# Altium project tinyusbboard.PrjPcb
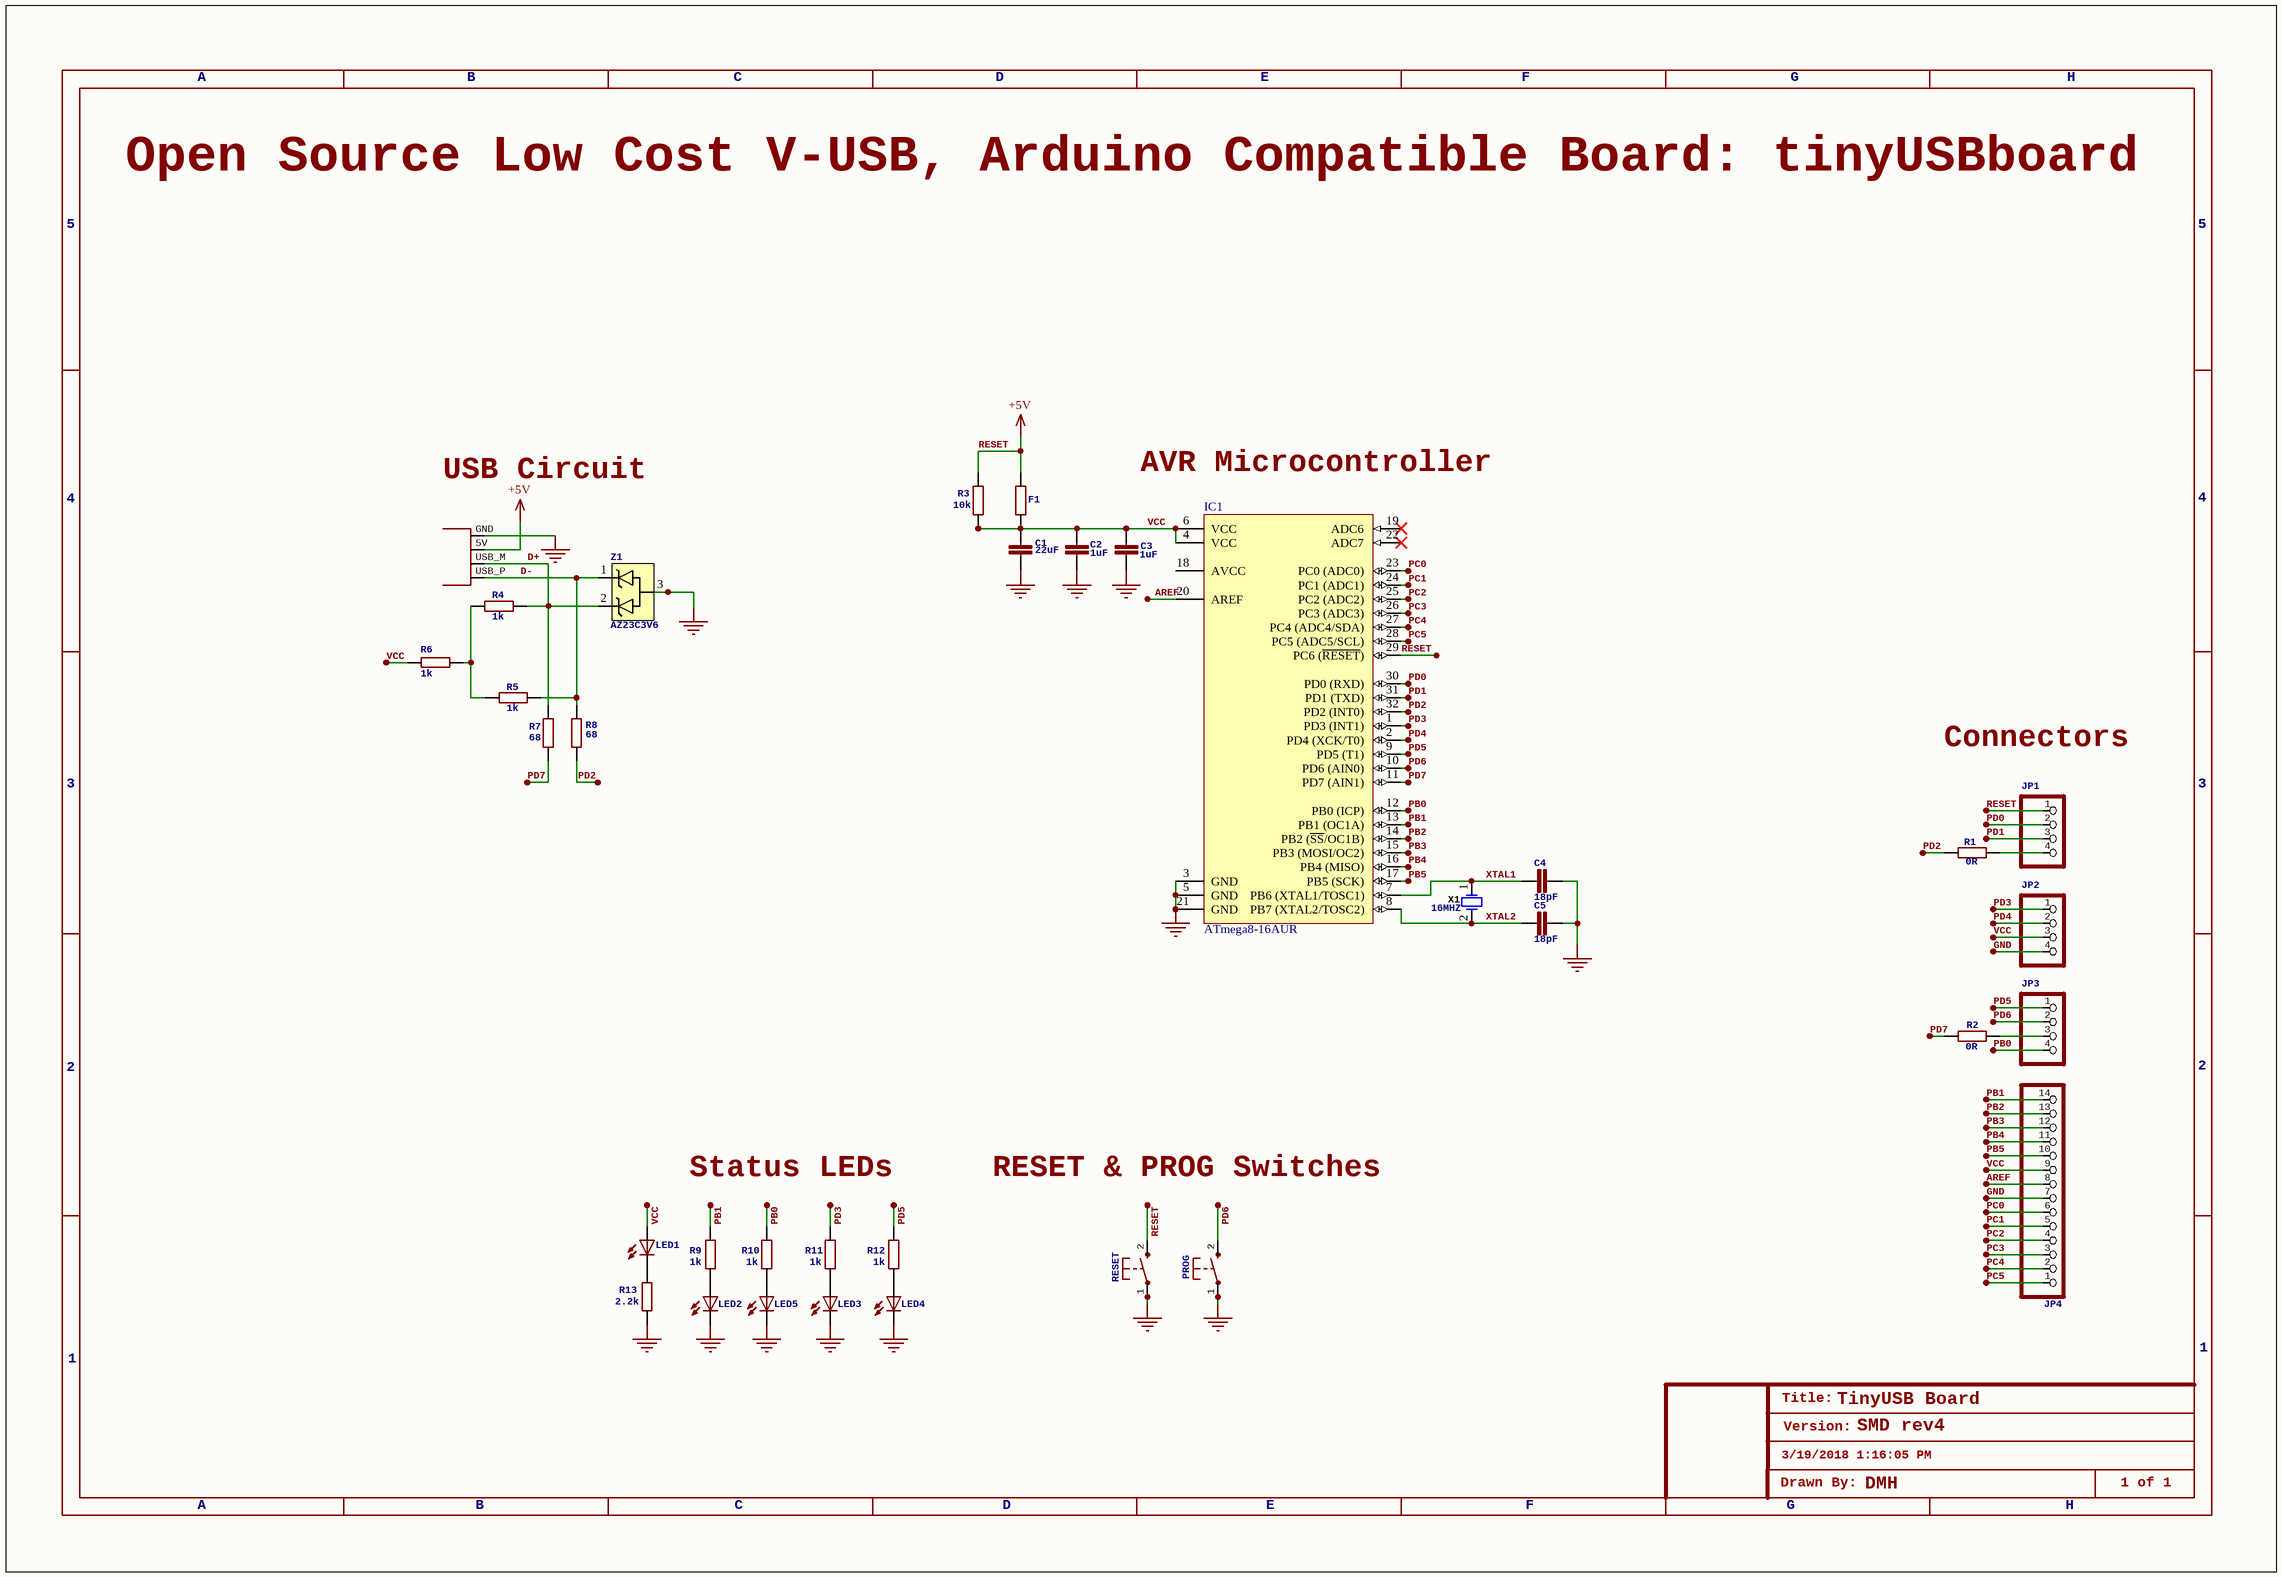
[diagram p0: tinyusbboard.SchDoc]
1 sheet, 34 parts. Net scope: global (net labels, ports and power ports of the same name join across sheets).
Board file: tinyusbboard.PcbDoc

## Sheet tinyusbboard.SchDoc: tinyusbboard
size 409 x 282 mm; Date: 3/19/2018 1:16:05 PM; CompanyName: Detex Corp; DrawnBy: DMH; Engineer: DMH; Organization: Detex Corp; Address1: 302 Detex Dr; Address2: New Braunfels, TX 78130; Revision: A0; SheetNumber: 1; SheetTotal: 1

### Parts
C1  22uF  [C1206K]
C2  1uF  [C0805]
C3  1uF  [C0805]
C4  18pF  [C0805]
C5  18pF  [C0805]
F1  0  [R1206W]  (value not drawn)
IC1  ATmega8-16AUR  [32A_M]
JP1  PINHD-1X4  [4P Jumper]  (value not drawn)
JP2  PINHD-1X4  [4P Jumper]  (value not drawn)
JP3  PINHD-1X4  [4P Jumper]  (value not drawn)
JP4  PINHD-1X14  [124P Jumper]  (value not drawn)
LED1  POWER  [LED_1206_2]  (value not drawn)
LED2  red  [LED_1206_2]  (value not drawn)
LED3  red  [LED_1206_2]  (value not drawn)
LED4  red  [LED_1206_2]  (value not drawn)
LED5  red  [LED_1206_2]  (value not drawn)
PROG  KSS-2EG4430  [KSS-2EG4430]  (value not drawn)
R1  0R  [RESC0805(2012)_M]
R2  0R  [RESC0805(2012)_M]
R3  10k  [RESC0805(2012)_M]
R4  1k  [RESC0805(2012)_M]
R5  1k  [RESC0805(2012)_M]
R6  1k  [RESC0805(2012)_M]
R7  68  [RESC0805(2012)_M]
R8  68  [RESC0805(2012)_M]
R9  1k  [RESC0805(2012)_M]
R10  1k  [RESC0805(2012)_M]
R11  1k  [RESC0805(2012)_M]
R12  1k  [RESC0805(2012)_M]
R13  2.2k  [RESC0805(2012)_M]
RESET  KSS-2EG4430  [KSS-2EG4430]  (value not drawn)
USB  USBPCB  [USB-A-PCB]  (value not drawn)
X1  16MHZ  [JPY-HC-49US]
Z1  AZ23C3V6  [SOT23_M]

### Nets
GND: C1.2 C2.2 C3.2 C4.2 C5.2 IC1.3(GND) IC1.5(GND) IC1.21(GND) JP2.4 JP4.7 LED2.C LED3.C LED4.C LED5.C PROG.1(P) R13.2 RESET.1(P) USB.GND Z1.3
RESET: F1.1 IC1.29(PC6_(~{RESET})) JP1.1 R3.1 RESET.2(S) USB.5V(VBUS)  [also labelled +5V]
AREF: IC1.20(AREF) JP4.8
D+: R4.2 R7.2 USB.USB_M(D-) Z1.2
D-: R5.2 R8.2 USB.USB_P(D+) Z1.1
PB0: IC1.12(PB0_(ICP)) JP3.4 R10.1
PB1: IC1.13(PB1_(OC1A)) JP4.14 R9.1
PB2: IC1.14(PB2_(~{SS}/OC1B)) JP4.13
PB3: IC1.15(PB3_(MOSI/OC2)) JP4.12
PB4: IC1.16(PB4_(MISO)) JP4.11
PB5: IC1.17(PB5_(SCK)) JP4.10
PC0: IC1.23(PC0_(ADC0)) JP4.6
PC1: IC1.24(PC1_(ADC1)) JP4.5
PC2: IC1.25(PC2_(ADC2)) JP4.4
PC3: IC1.26(PC3_(ADC3)) JP4.3
PC4: IC1.27(PC4_(ADC4/SDA)) JP4.2
PC5: IC1.28(PC5_(ADC5/SCL)) JP4.1
PD0: IC1.30(PD0_(RXD)) JP1.2
PD1: IC1.31(PD1_(TXD)) JP1.3
PD2: IC1.32(PD2_(INT0)) R1.1 R8.1
PD3: IC1.1(PD3_(INT1)) JP2.1 R11.1
PD4: IC1.2(PD4_(XCK/T0)) JP2.2
PD5: IC1.9(PD5_(T1)) JP3.1 R12.1
PD6: IC1.10(PD6_(AIN0)) JP3.2 PROG.2(S)
PD7: IC1.11(PD7_(AIN1)) R2.1 R7.1
VCC: C1.1 C2.1 C3.1 F1.2 IC1.4(VCC) IC1.6(VCC) JP2.3 JP4.9 LED1.A R3.2 R6.2
XTAL1: C4.1 IC1.7(PB6_(XTAL1/TOSC1)) X1.1
XTAL2: C5.1 IC1.8(PB7_(XTAL2/TOSC2)) X1.2
NetJP1_4: JP1.4 R1.2
NetJP3_3: JP3.3 R2.2
NetLED1_C: LED1.C R13.1
NetLED2_A: LED2.A R9.2
NetLED3_A: LED3.A R11.2
NetLED4_A: LED4.A R12.2
NetLED5_A: LED5.A R10.2
NetR4_1: R4.1 R5.1 R6.1

Not connected (* = marked no-connect by the designer): IC1 18(AVCC) 19(ADC6)* 22(ADC7)*

### Notes on the sheet
- A
- B
- C
- D
- E
- F
- G
- H
- Open Source Low Cost V-USB, Arduino Compatible Board: tinyUSBboard
- 5
- AVR Microcontroller
- 4
- (near USB) USB Circuit
- Connectors
- 3
- 2
- Status LEDs
- RESET & PROG Switches
- 1
- 3/19/2018 1:16:05 PM
- Title:
- Version:
- TinyUSB Board
- SMD rev4
- Drawn By:
- DMH
- 1 of 1

### Library data of the parts
C1 = C-EUC1206K: CAPACITOR, European symbol; NAME: *
C2-C5 = C-EUC0805K: CAPACITOR, European symbol
  C2 C3: NAME: *
F1 = R-EU_R1206W: RESISTOR, European symbol; NAME: *
IC1 = CMP-0095-00566-1: 8-bit AVR Microcontroller, 4.5-5.5V, 16MHz, 8KB Flash, 512 Bytes EEPROM, 1KB SRAM, 32-pin TQFP, Industrial Grade (-40°C to 85°C), Reel; Code_JEDEC: MS-026-ABA; PackageReference: 32A; PackageDescription: 32-Lead, 7x7x1.0 mm Body, 0.8mm Lead Pitch, Thin Profile Plastic Quad Flat Package (TQFP); ComponentLink2URL: http://www.atmel.com/dyn/resources/prod_documents/doc2486.pdf; PackageVersion: revC, Oct-2010; ComponentLink2Description: ATmega8(L); ComponentLink3URL: http://www.atmel.com/dyn/resources/prod_documents/2486S.pdf; ComponentLink3Description: ATmega8(L) Summary; ComponentLink1URL: http://www.atmel.com/; DatasheetVersion: revZ, Feb-2011; ComponentLink1Description: Manufacturer URL
JP1-JP3 = PINHD-1X4: PIN HEADER
JP4 = PINHD-1X14: PIN HEADER
LED1-LED5 = LEDCHIPLED_0805: LED   OSRAM: - CHIPLED LG R971, LG N971, LY N971, LG Q971, LY Q971, LO R971, LY R971 LH N974, LH R974 LS Q976, LO Q976, LY Q976 LO Q996 - Hyper CHIPLED LW Q18S LB Q993, LB Q99A, LB R99A - SideLED LS A670, LO A670, LY A670, LG A670, LP A670 LB A673, LV A673, LT A673, LW A673 LH A674 LY A675 LS A676, LA A676, LO A676, LY A676, LW A676 LS A679, LY A679, LG A679 -  Hyper Micro SIDELEDÂ® LS Y876, LA Y876, LO Y876, LY Y876 LT Y87S - SmartLED LW L88C, LW L88S LB L89C, LB L89S, LG L890 LS L89K, LO L89K, LY L89K LS L896, LA L896, LO L896, LY L896 - TOPLED LS T670, LO T670, LY T670, LG T670, LP T670 LSG T670, LSP T670, LSY T670, LOP T670, LYG T670 LG T671, LOG T671, LSG T671 LB T673, LV T673, LT T673, LW T673 LH T674 LS T676, LA T676, LO T676, LY T676, LB T676, LH T676, LSB T676, LW T676 LB T67C, LV T67C, LT T67C, LS T67K, LO T67K, LY T67K, LW E67C LS E67B, LA E67B, LO E67B, LY E67B, LB E67C, LV E67C, LT E67C LW T67C LS T679, LY T679, LG T679 LS T770, LO T770, LY T770, LG T770, LP T770 LB T773, LV T773, LT T773, LW T773 LH T774 LS E675, LA E675, LY E675, LS T675 LS T776, LA T776, LO T776, LY T776, LB T776 LHGB T686 LT T68C, LB T68C - Hyper Mini TOPLEDÂ® LB M676 - Mini TOPLED SantanaÂ® LG M470 LS M47K, LO M47K, LY M47K    Source: http://www.osram.convergy.de   LUXEON: - LUMILEDÂ® LXK2-PW12-R00, LXK2-PW12-S00, LXK2-PW14-U00, LXK2-PW14-V00 LXK2-PM12-R00, LXK2-PM12-S00, LXK2-PM14-U00 LXK2-PE12-Q00, LXK2-PE12-R00, LXK2-PE12-S00, LXK2-PE14-T00, LXK2-PE14-U00 LXK2-PB12-K00, LXK2-PB12-L00, LXK2-PB12-M00, LXK2-PB14-N00, LXK2-PB14-P00, LXK2-PB14-Q00 LXK2-PR12-L00, LXK2-PR12-M00, LXK2-PR14-Q00, LXK2-PR14-R00 LXK2-PD12-Q00, LXK2-PD12-R00, LXK2-PD12-S00 LXK2-PH12-R00, LXK2-PH12-S00 LXK2-PL12-P00, LXK2-PL12-Q00, LXK2-PL12-R00    Source: www.luxeon.com   KINGBRIGHT:   KA-3528ASYC Source: www.kingbright.com
PROG RESET = KSS-2EG4430: Size: 3x6mm  Height: 5mm from PCB  Rating: DC12v 50mA  Travel: 0.25Â±0.10mm  Operating Force: 180Â±50gf  Return Force: 60gf min  Contact resistance: 100m? max  Insulation resistance: 100M? min  Operating life?50,000 cycles; NAME: *
R1-R13 = R-EU_R0805W: RESISTOR, European symbol
  R1-R3 R7 R8: NAME: *
USB = USBPCB: USB Connectors   USB-B-PTH is fully proven SKU : PRT-00139    USB-miniB is fully proven SKU : PRT-00587    USB-A-PCB is untested.    USB-A-H is throughly reviewed, but untested. Spark Fun Electronics SKU : PRT-00437    USB-B-SMT is throughly reviewed, but untested. Needs silkscreen touching up.    USB-A-S has not been used/tested    USB-MB-H has not been used/tested; USB: USB
X1 = CMP-2100-03645-1: Crystal, 16 MHz, +/- 30 ppm, 18 pF, -20 to 70 degC, 2-Pin THD; Manufacturer: Jing peng yuan; Datasheet URL: https://statics3.seeedstudio.com/images/opl/datasheet/306010014.pdf; Package Description: 2-Pin Throug Hole Device, Body 11.05 x 4.65 mm, Pitch 4.9 mm; Datasheet Version: 42125.0; Package Reference: HC-49US
Z1 = DUAL_ZENER: 3.6V Zener Diode, Dual Common Anode; Manufacturer: Vishay Semi; Package: SOT-23; MPN: AZ23C3V6